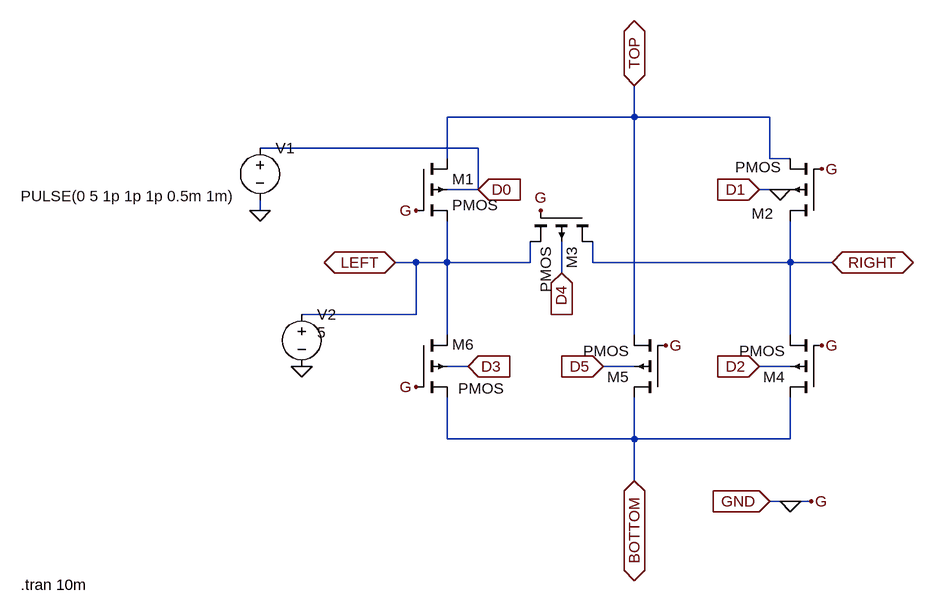
[diagram p0: schematic SWITCH.asc]
SWITCH.asc, the LTspice schematic file:
Version 4
SHEET 1 888 720
WIRE 384 -48 384 -96
WIRE 384 -48 96 -48
WIRE 592 -48 384 -48
WIRE 144 0 -192 0
WIRE 96 16 96 -48
WIRE 592 16 592 -48
WIRE 624 16 592 16
WIRE 144 64 144 0
WIRE 144 64 96 64
WIRE 608 64 576 64
WIRE 624 64 608 64
WIRE -192 96 -192 80
WIRE 48 176 16 176
WIRE 96 176 96 112
WIRE 96 176 48 176
WIRE 224 176 224 144
WIRE 224 176 96 176
WIRE 320 176 320 144
WIRE 624 176 624 112
WIRE 624 176 320 176
WIRE 688 176 624 176
WIRE 272 192 272 144
WIRE 48 256 48 176
WIRE 48 256 -128 256
WIRE 96 288 96 176
WIRE 384 288 384 -48
WIRE 624 288 624 176
WIRE 128 336 96 336
WIRE 384 336 336 336
WIRE 624 336 576 336
WIRE 96 448 96 384
WIRE 384 448 384 384
WIRE 384 448 96 448
WIRE 624 448 624 384
WIRE 624 448 384 448
WIRE 384 512 384 448
WIRE 624 544 592 544
WIRE 656 544 624 544
FLAG 144 64 D0
IOPIN 144 64 In
FLAG 576 64 D1
IOPIN 576 64 In
FLAG 576 336 D2
IOPIN 576 336 In
FLAG 128 336 D3
IOPIN 128 336 In
FLAG 272 192 D4
IOPIN 272 192 In
FLAG 336 336 D5
IOPIN 336 336 In
FLAG 384 -96 TOP
IOPIN 384 -96 BiDir
FLAG 384 512 BOTTOM
IOPIN 384 512 BiDir
FLAG 16 176 LEFT
IOPIN 16 176 BiDir
FLAG 688 176 RIGHT
IOPIN 688 176 BiDir
FLAG 48 368 G
FLAG 48 96 G
FLAG 240 96 G
FLAG 672 32 G
FLAG 672 304 G
FLAG 432 304 G
FLAG 592 544 GND
IOPIN 592 544 In
FLAG 656 544 G
FLAG -192 96 0
FLAG 624 544 0
FLAG -128 336 0
FLAG 608 64 0
SYMBOL pmos4 48 16 R0
SYMATTR InstName M1
SYMBOL pmos4 672 112 R180
WINDOW 0 74 11 Left 2
WINDOW 3 62 83 Left 2
SYMATTR InstName M2
SYMBOL pmos4 672 384 R180
SYMATTR InstName M4
SYMBOL pmos4 432 384 R180
SYMATTR InstName M5
SYMBOL pmos4 48 288 R0
WINDOW 0 56 14 Left 2
WINDOW 3 65 82 Left 2
SYMATTR InstName M6
SYMBOL pmos4 320 96 R90
SYMATTR InstName M3
SYMBOL voltage -192 -16 R0
WINDOW 3 -368 90 Left 2
WINDOW 123 0 0 Left 0
WINDOW 39 0 0 Left 0
SYMATTR Value PULSE(0 5 1p 1p 1p 0.5m 1m)
SYMATTR InstName V1
SYMBOL voltage -128 240 R0
WINDOW 3 24 44 Left 2
WINDOW 123 0 0 Left 0
WINDOW 39 0 0 Left 0
SYMATTR Value 5
SYMATTR InstName V2
TEXT -560 672 Left 2 !.tran 10m

The netlist it stands for:
* SWITCH.asc
M1 TOP 0 LEFT D0 PMOS
M2 RIGHT 0 TOP 0 PMOS
M4 BOTTOM 0 RIGHT D2 PMOS
M5 BOTTOM 0 TOP D5 PMOS
M6 LEFT 0 BOTTOM D3 PMOS
M3 RIGHT 0 LEFT D4 PMOS
V1 D0 0 PULSE(0 5 1p 1p 1p 0.5m 1m)
V2 LEFT 0 5
.model NMOS NMOS
.model PMOS PMOS
.lib standard.mos
.tran 10m
.backanno
.end

* Results of the author's LTspice run, read from the files saved beside the schematic
* Operating Point, zero values left out:
*   V(top) = 608.4 mV
*   V(left) = 5 V
*   V(right) = 626.3 mV
*   V(bottom) = 2.93 V
*   V(d2) = 2.771 V
*   V(d5) = 2.771 V
*   V(d3) = 4.832 V
*   V(d4) = 4.824 V
*   Id(M3) = -246.1 µA
*   Ib(M3) = -4.824 pA
*   Is(M3) = 246.1 µA
*   Id(M6) = 164.1 µA
*   Ib(M6) = -4.832 pA
*   Is(M6) = -164.1 µA
*   Id(M5) = 82.17 µA
*   Ib(M5) = -2.771 pA
*   Is(M5) = -82.17 µA
*   Id(M4) = 81.95 µA
*   Ib(M4) = -2.771 pA
*   Is(M4) = -81.95 µA
*   Id(M2) = 328 µA
*   Ib(M2) = -492.2 µA
*   Is(M2) = 164.1 µA
*   Id(M1) = -81.95 µA
*   Ib(M1) = -3.572 TA
*   Is(M1) = 3.572 TA
*   I(V2) = -3.572 TA
*   I(V1) = 3.572 TA
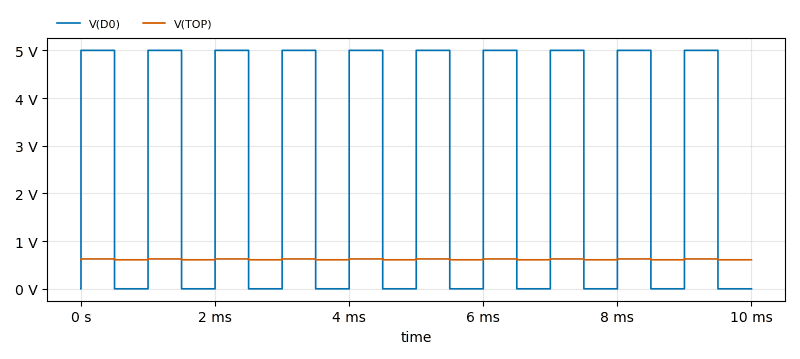
[diagram p1: Transient Analysis of SWITCH.asc, plotted from the saved traces]
* Transient Analysis, 1 run:
*   V(D0): min 0 V, max 5 V, average 2.5 V, rms 3.536 V, last 0 V
*   V(TOP): min 608.4 mV, max 626.5 mV, average 617.4 mV, rms 617.4 mV, last 608.4 mV